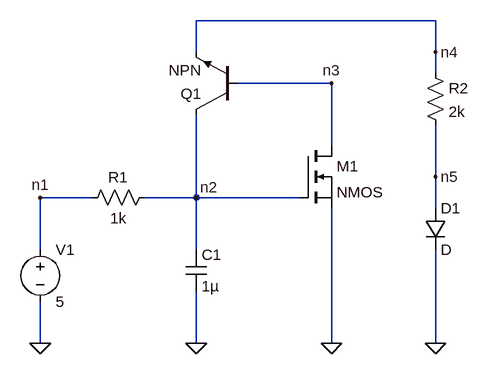
[diagram p0: schematic netlist_example2.asc]
netlist_example2.asc, the LTspice schematic file:
Version 4.1
SHEET 1 916 680
WIRE 640 -224 272 -224
WIRE 272 -176 272 -224
WIRE 640 -176 640 -224
WIRE 640 -144 640 -176
WIRE 480 -128 336 -128
WIRE 480 -32 480 -128
WIRE 640 16 640 -64
WIRE 112 48 32 48
WIRE 272 48 272 -80
WIRE 272 48 192 48
WIRE 432 48 272 48
WIRE 640 64 640 16
WIRE 32 128 32 48
WIRE 272 128 272 48
WIRE 32 272 32 208
WIRE 272 272 272 192
WIRE 480 272 480 64
WIRE 640 272 640 128
FLAG 32 48 n1
FLAG 272 48 n2
FLAG 480 -128 n3
FLAG 640 -176 n4
FLAG 640 272 0
FLAG 272 272 0
FLAG 32 272 0
FLAG 480 272 0
FLAG 640 16 n5
SYMBOL voltage 32 112 R0
WINDOW 123 0 0 Left 0
WINDOW 39 0 0 Left 0
SYMATTR InstName V1
SYMATTR Value 5
SYMBOL res 208 32 R90
WINDOW 0 0 56 VBottom 2
WINDOW 3 32 56 VTop 2
SYMATTR InstName R1
SYMATTR Value 1k
SYMBOL cap 256 128 R0
SYMATTR InstName C1
SYMATTR Value 1µ
SYMBOL nmos 432 -32 R0
SYMATTR InstName M1
SYMBOL res 624 -160 R0
SYMATTR InstName R2
SYMATTR Value 2k
SYMBOL npn 336 -80 R180
SYMATTR InstName Q1
SYMBOL diode 624 64 R0
SYMATTR InstName D1

The netlist it stands for:
* netlist_example2.asc
V1 n1 0 5
R1 n2 n1 1k
C1 n2 0 1µ
M1 n3 n2 0 0 NMOS
R2 n4 n5 2k
Q1 n2 n3 n4 0 NPN
D1 n5 0 D
.model D D
.lib standard.dio
.model NPN NPN
.model PNP PNP
.lib standard.bjt
.model NMOS NMOS
.model PMOS PMOS
.lib standard.mos
.backanno
.end